# EAGLE design ReButton-ES2 (EAGLE 7.7.0)

## Sheet 1 of 3
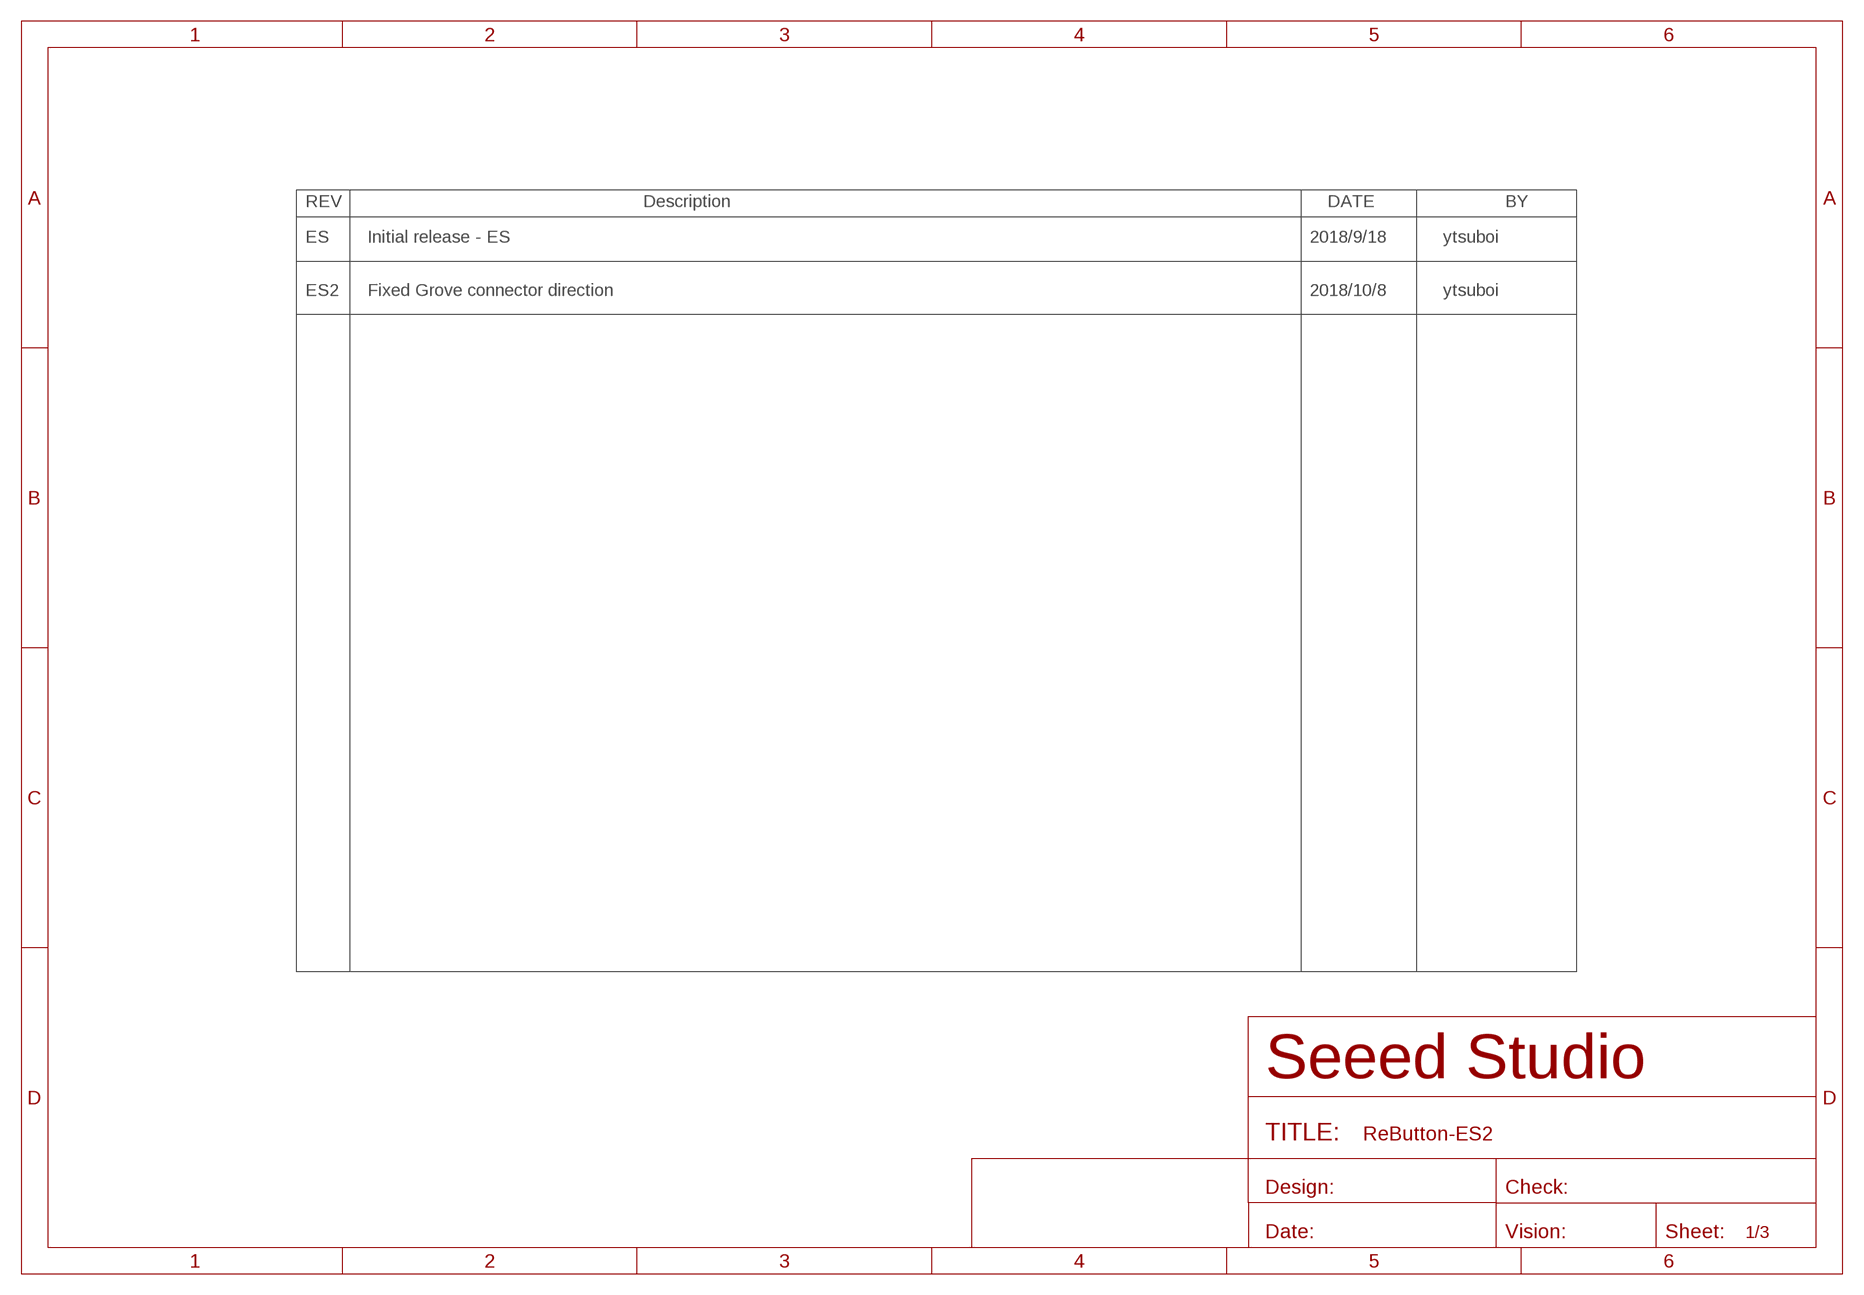
[diagram p0: schematic, sheet 1]

### Notes on the sheet
- ES | Initial release - ES | 2018/9/18 | ytsuboi
- ES2 | Fixed Grove connector direction | 2018/10/8 | ytsuboi

## Sheet 2 of 3
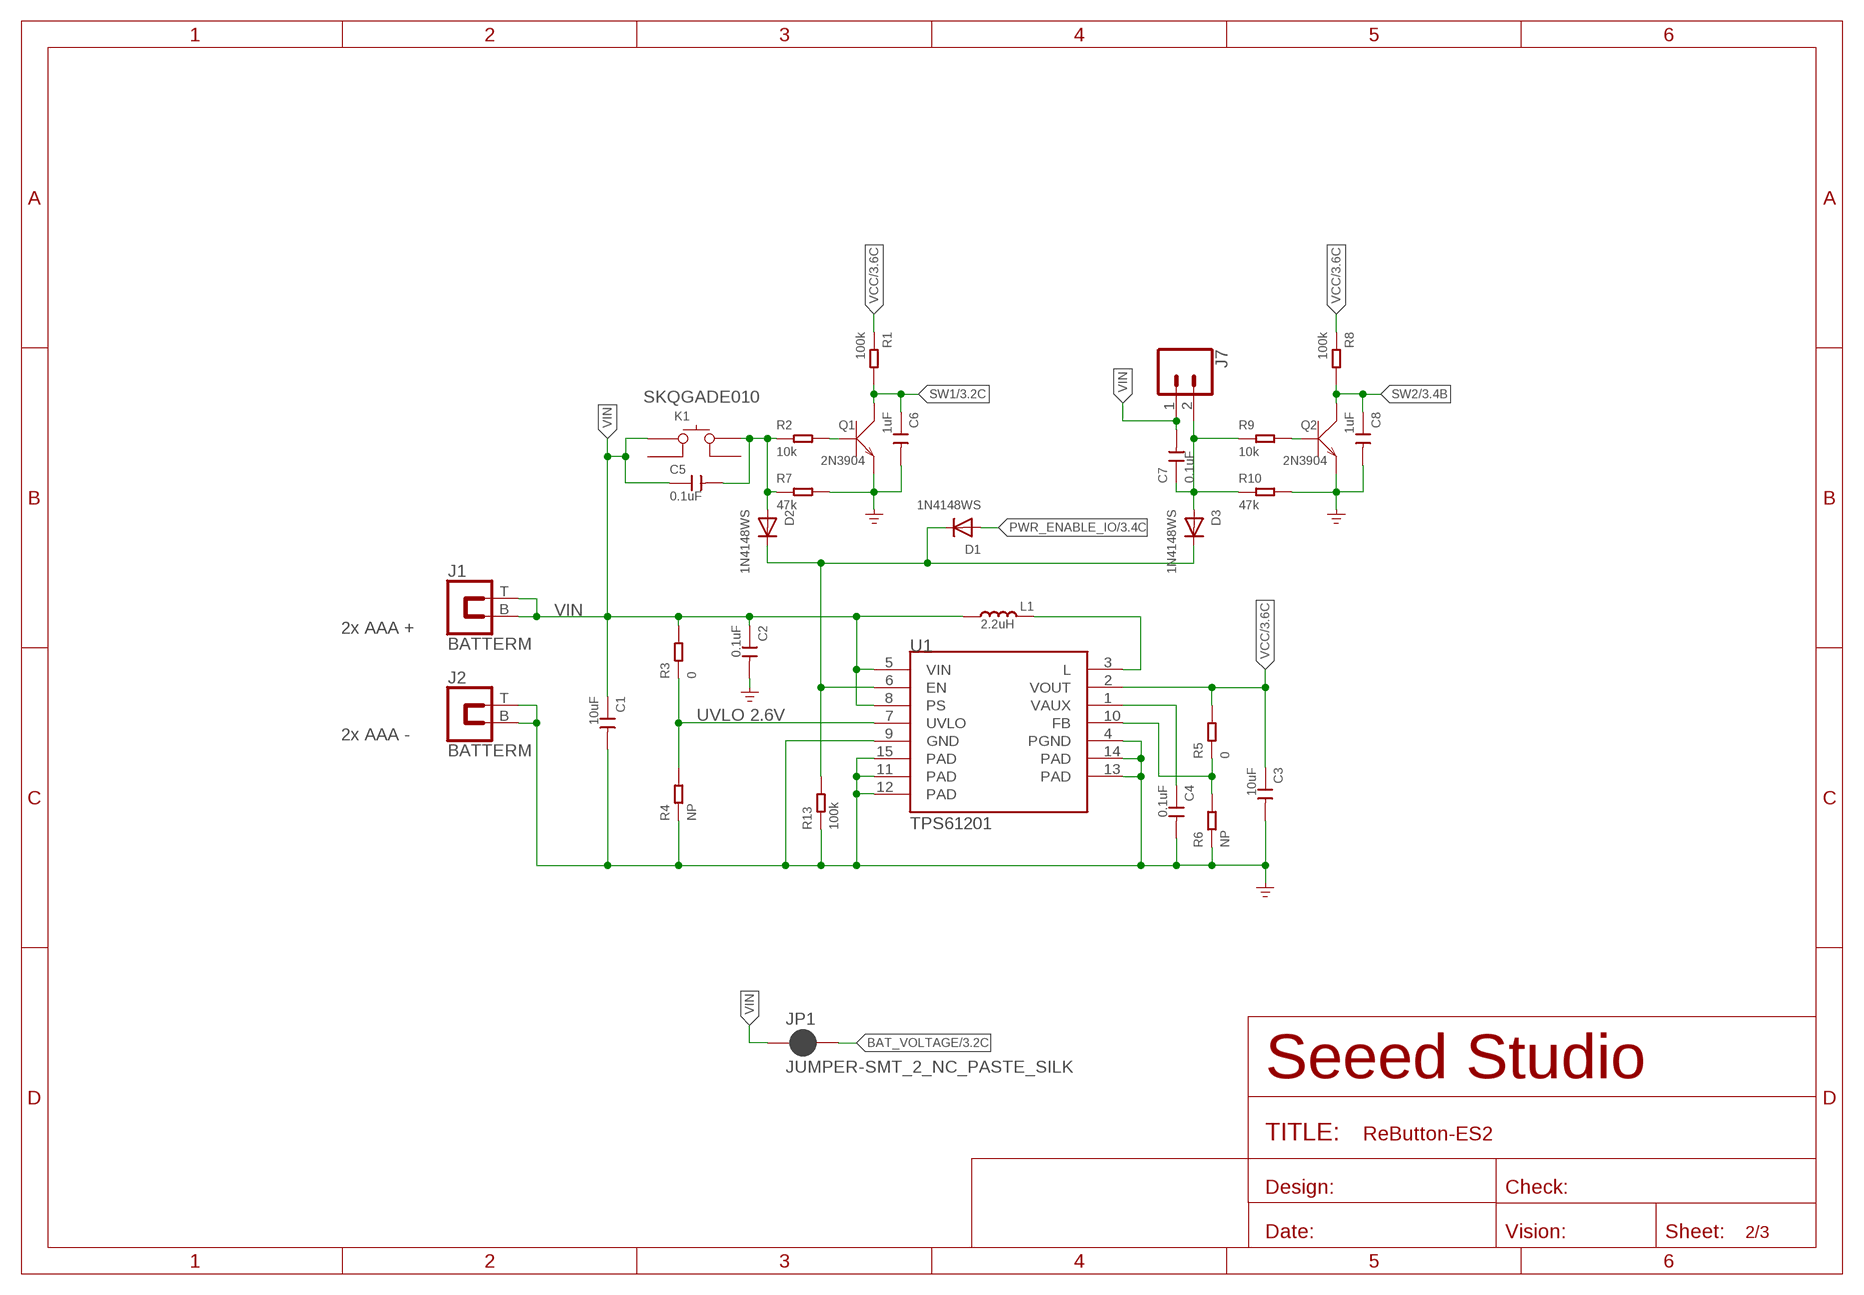
[diagram p1: schematic, sheet 2]

### Parts
C1  10uF  CAP-0805  [C0805]
C2  0.1uF  CAP-0402  [C0402]
C3  10uF  CAP-0805  [C0805]
C4  0.1uF  CAP-0402  [C0402]
C5  0.1uF  CAP-0402  [C0402]
C6  1uF  CAP-0402  [C0402]
C7  0.1uF  CAP-0402  [C0402]
C8  1uF  CAP-0402  [C0402]
D1  1N4148WS  DIODESOD-323  [SOD-323]
D2  1N4148WS  DIODESOD-323  [SOD-323]
D3  1N4148WS  DIODESOD-323  [SOD-323]
J1  BATTERM  [BATTERM]
J2  BATTERM  [BATTERM]
J7  CONN_02LOCK  [1X02_LOCK]
JP1  JUMPER-SMT_2_NC_PASTE_SILK  [SMT-JUMPER_2_NC_PASTE_SILK]
K1  BUTTON-4P-6.2X6.2  [SW4-SMD-6.2X6.2MM]
L1  2.2uH  L-NR3012  [L3030-TAIYO-YUDEN-NR3012]
Q1  2N3904  TRANSISTOR-NPN-SOT23  [SOT-23]
Q2  2N3904  TRANSISTOR-NPN-SOT23  [SOT-23]
R1  100k  RES-0402  [R0402]
R2  10k  RES-0402  [R0402]
R3  0  RES-0402  [R0402]
R4  NP  RES-0402  [R0402]
R5  0  RES-0402  [R0402]
R6  NP  RES-0402  [R0402]
R7  47k  RES-0402  [R0402]
R8  100k  RES-0402  [R0402]
R9  10k  RES-0402  [R0402]
R10  47k  RES-0402  [R0402]
R13  100k  RES-0402  [R0402]
U1  TPS61201  TPS61200  [QFN-10_PAD]

### Nets
BAT_VOLTAGE: JP1.2 ; also sheet 3
FB: R5.1 R6.2 U1.10(FB)
GND: C1.2 C2.2 C3.2 C4.2 C6.2 C8.2 J2.B J2.T Q1.2(E) Q2.2(E) R4.1 R6.1 R7.2 R10.2 R13.1 U1.4(PGND) U1.9(GND) U1.11(PAD) U1.12(PAD) U1.13(PAD) U1.14(PAD) U1.15(PAD) ; supply symbol labelled GND_POWER ; also sheet 3
N$1: C4.1 U1.1(VAUX)
N$2: L1.2 U1.3(L)
N$3: D1.C D2.C D3.C R13.2 U1.6(EN)
N$4: Q1.1(B) R2.2
N$5: C5.2 D2.A K1.2(B0) R2.1 R7.1
N$7: C7.1 D3.A J7.2 R9.1 R10.1
N$8: Q2.1(B) R9.2
PWR_ENABLE_IO: D1.A ; also sheet 3
SW1: C6.1 Q1.3(C) R1.2 ; also sheet 3
SW2: C8.1 Q2.3(C) R8.2 ; also sheet 3
UVLO: R3.1 R4.2 U1.7(UVLO)
VCC: C3.1 R1.1 R5.2 R8.1 U1.2(VOUT) ; also sheet 3
VIN: C1.1 C2.1 C5.1 C7.2 J1.B J1.T J7.1 JP1.1 K1.1(A0) L1.1 R3.2 U1.5(VIN) U1.8(PS)
Unconnected: K1.3(B1) K1.4(A1)

### Notes on the sheet
- SKQGADE010
- 2x AAA +
- UVLO 2.6V
- 2x AAA -

## Sheet 3 of 3
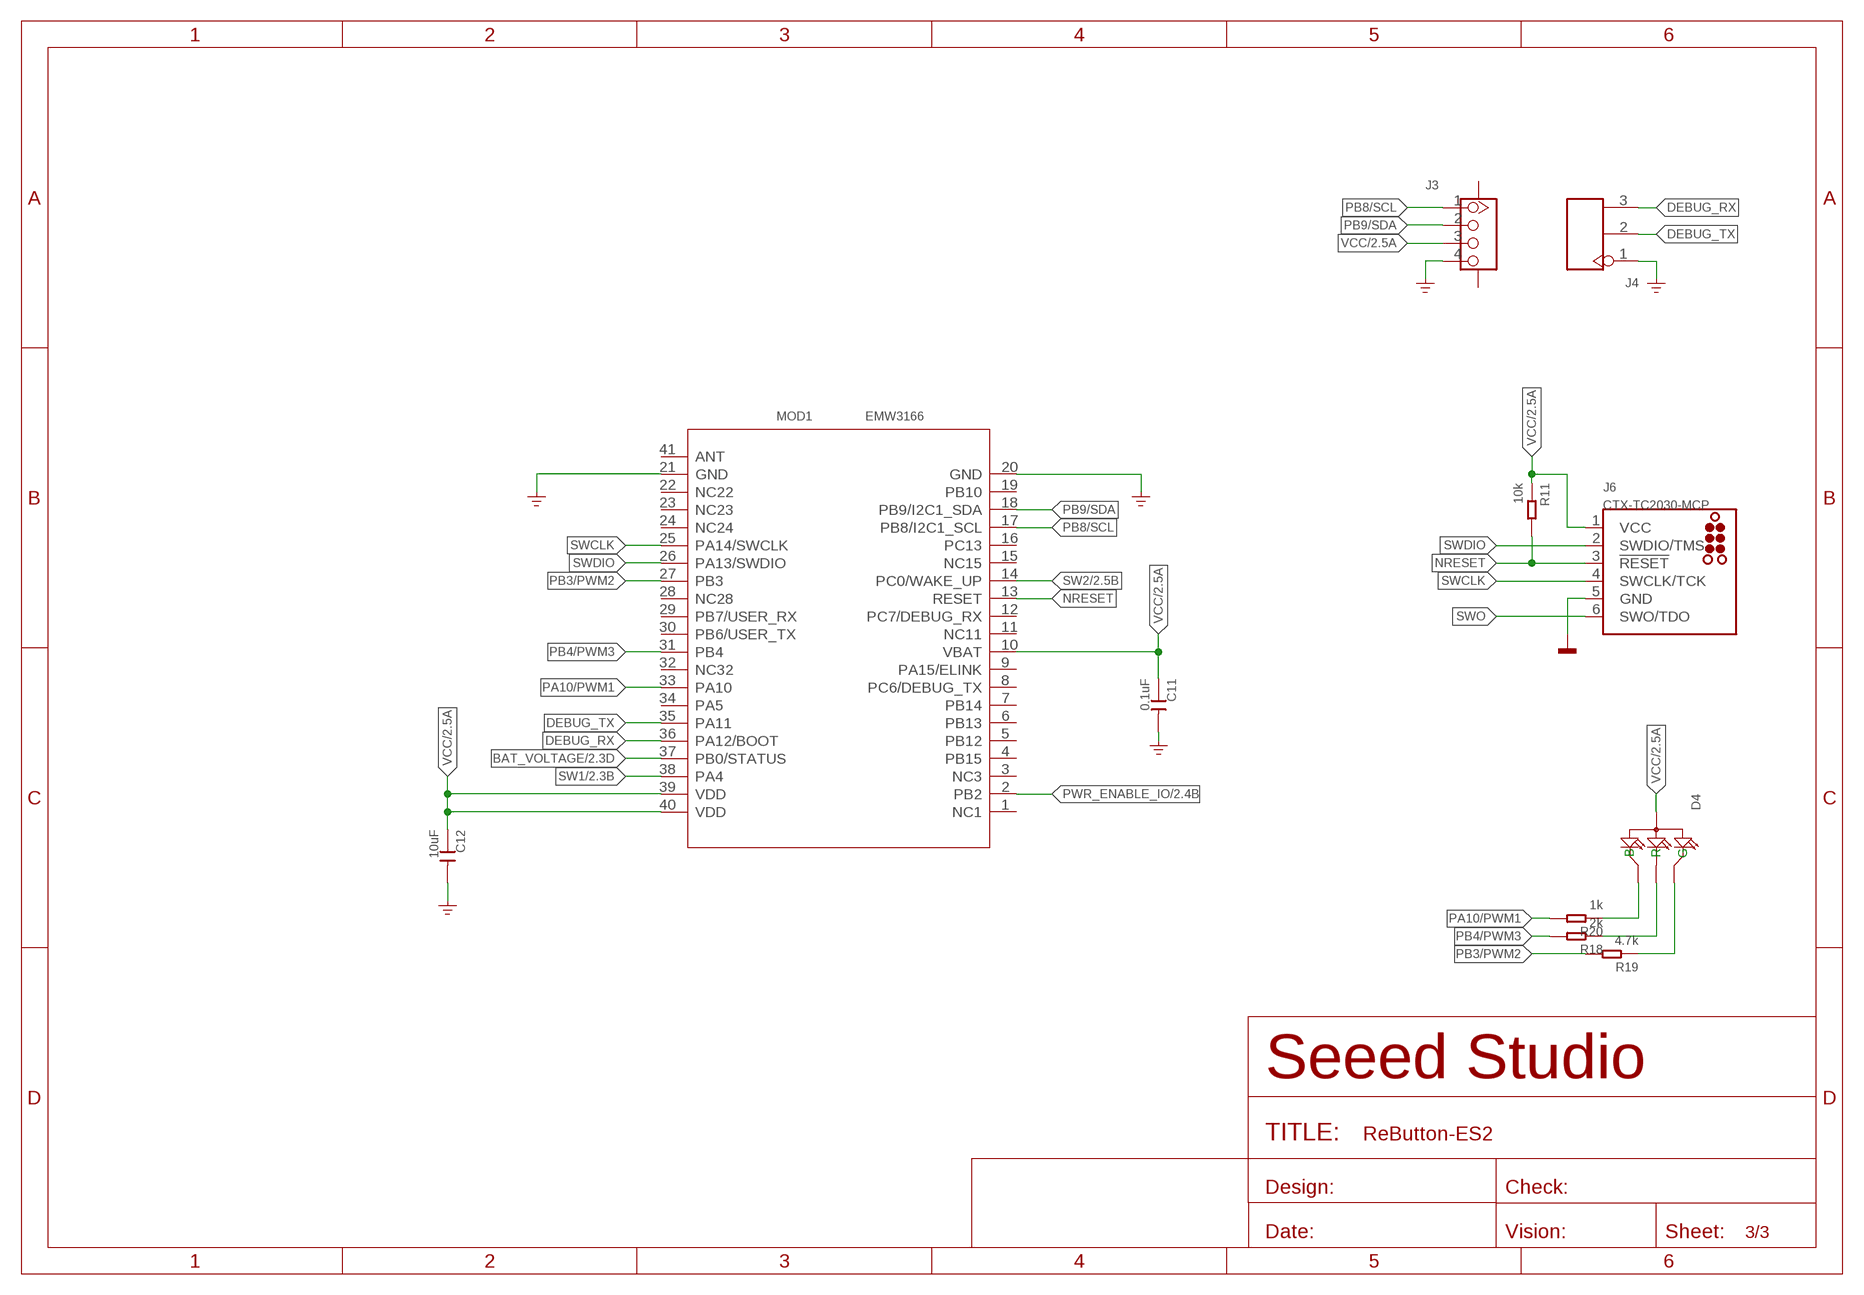
[diagram p2: schematic, sheet 3]

### Parts
C11  0.1uF  CAP-0402  [C0402]
C12  10uF  CAP-0805  [C0805]
D4  LED-ARGB-4P-19-237  [LED4-1.6X1.6X0.35MM]
J3  GROVE-CONNECTOR-SMD'DD'  [HW4-SMD-2.0]
J4  HEADER-3P  [H3-2.3-65/35MIL]
J6  CTX-TC2030-MCP  [TC2030-MCP]
MOD1  EMW3166  MODULE-WIFI-EMW3166  [MODULE-WIFI-EMW3166]
R11  10k  RES-0402  [R0402]
R18  2k  RES-0402  [R0402]
R19  4.7k  RES-0402  [R0402]
R20  1k  RES-0402  [R0402]

### Nets
BAT_VOLTAGE: MOD1.37(PB0/STATUS) ; also sheet 2
DEBUG_RX: J4.3 MOD1.36(PA12/BOOT)
DEBUG_TX: J4.2 MOD1.35(PA11)
GND: C11.2 C12.2 J3.4 J4.1 J6.5(GND) MOD1.20(GND) MOD1.21(GND) ; supply symbol labelled GND_POWER ; also sheet 2
N$6: D4.4(R) R18.1
N$9: D4.2(G) R19.1
N$10: D4.1(B) R20.1
NRESET: J6.3(!RESET!) MOD1.13(RESET) R11.2
PA10/PWM1: MOD1.33(PA10) R20.2
PB3/PWM2: MOD1.27(PB3) R19.2
PB4/PWM3: MOD1.31(PB4) R18.2
PB8/SCL: J3.1 MOD1.17(PB8/I2C1_SCL)
PB9/SDA: J3.2 MOD1.18(PB9/I2C1_SDA)
PWR_ENABLE_IO: MOD1.2(PB2) ; also sheet 2
SW1: MOD1.38(PA4) ; also sheet 2
SW2: MOD1.14(PC0/WAKE_UP) ; also sheet 2
SWCLK: J6.4(SWCLK/TCK) MOD1.25(PA14/SWCLK)
SWDIO: J6.2(SWDIO/TMS) MOD1.26(PA13/SWDIO)
SWO: J6.6(SWO/TDO)
VCC: C11.1 C12.1 D4.3(+) J3.3 J6.1(VCC) MOD1.10(VBAT) MOD1.39(VDD) MOD1.40(VDD) R11.1 ; also sheet 2
Unconnected: J3.SS1 J3.SS2 MOD1.1(NC1) MOD1.3(NC3) MOD1.4(PB15) MOD1.5(PB12) MOD1.6(PB13) MOD1.7(PB14) MOD1.8(PC6/DEBUG_TX) MOD1.9(PA15/ELINK) MOD1.11(NC11) MOD1.12(PC7/DEBUG_RX) MOD1.15(NC15) MOD1.16(PC13) MOD1.19(PB10) MOD1.22(NC22) MOD1.23(NC23) MOD1.24(NC24) MOD1.28(NC28) MOD1.29(PB7/USER_RX) MOD1.30(PB6/USER_TX) MOD1.32(NC32) MOD1.34(PA5) MOD1.41(ANT)

## Library data of the parts
C1-C8 C11 C12 = Discrete-new:CAP: Ceramic Capacitors
D1-D3 = microbuilder:DIODE: Diode SMA Model Volts Amps Type Vf Vr Digikey # Notes SSA34-E3 40V 3A Schottky 480mV @ 3A 200uA @ 40V SSA34-E3/61TGITR-ND CDBA120-G 20V 1A Schottky 500mV @ 1A 500uA @ 20V 641-1014-6-ND REEL MBRA210 10V 2A Schottky 350mV @ 2A 700uA @ 10V MBRA210LT3 SOD-123 Model Volts Amps Type Vf Vr Order # Notes BAT54T1G 30V 200mA Schottky 800mV @ 200mA 2uA @ 25V BAT54T1GOSTR-ND B0530W 30V 500mA Schottky 430mV @ 500mA 130uA @ 30V B0530W-FDICT-ND REEL MBR120 1A 20V Schottky 340mV @ 1A MBR120VLSFT1GOSCT-ND SOD-323 Model Volts Amps Type Vf Vr Order # Notes PMEG2005EJ 20V 500mA Schottky 355mV @ 500mA 568-4110-1-ND ZLLS410 10V 570mA Schottky 380mV @ 570mA ZLLS410CT-ND 1N4148WS 75V 150mA Silicon/Simple 1V 1N4148WSFSCT-ND REEL SOD-523 Model Volts Amps Type Vf Vr Order # Notes BAT54XV2 30V 200mA Schottky 0.8V @ 100mA BAT54XV2CT-ND TB751S 30V 30mA Schottky RB751S-40TE61CT-ND SOT23-R/W (R = Solder Paste/Reflow Ovens, W = Hand-Soldering) Model Volts Amps Type Vf Vr Order # Notes BAT54FILM 40V 300mA Schottky 497-7162-1-ND
D4 = Discrete-new:LED-ARGB-4P
J1 J2 = batterm:BATTERM
J3 = Connector-new:GROVE-CONNECTOR-SMD: 4P-SMD-2.0:320110030;4P-SMD-2.0-90D:320110032
J4 = Connector-new:HEADER-3P
J6 = tag-connect:CTX-TC2030: TAG-CONNECT 10-Pin Cortex Debug Connector Manufacturer: Tag-Connect <http://www.tag-connect.com> Cable for easy In-Circuit Serial Programming. Designed for ARM Cortex processors. Two variants - one "with legs" (for hands-free fit on PCB) and another "without legs" for quick programming. PAD Description 1 VCC 2 SWDIO/TMS 3 nRESET 4 SWCLK/TCK 5 GND 6 SWO/TDO Modified and updated by Yoshihiro TSUBOI ‹ytsuboi@gmail.com›
J7 = SparkFun-Connectors:CONN_02: Multi connection point. Often used as Generic Header-pin footprint for 0.1 inch spaced/style header connections On any of the 0.1 inch spaced packages, you can populate with these: Break Away Headers - Straight <https://www.sparkfun.com/products/116> (PRT-00116) Break Away Male Headers - Right Angle <https://www.sparkfun.com/products/553> (PRT-00553) Female Headers <https://www.sparkfun.com/products/115> (PRT-00115) Break Away Headers - Machine Pin <https://www.sparkfun.com/products/117> (PRT-00117) Break Away Female Headers - Swiss Machine Pin <https://www.sparkfun.com/products/743> (PRT-00743) For SCREWTERMINALS and SPRING TERMINALS visit here: Screw Terimnals on SparkFun.com <https://www.sparkfun.com/search/results?term=Screw+Terminals> (5mm/3.5mm/2.54mm spacing) This device is also useful as a general connection point to wire up your design to another part of your project. Our various solder wires solder well into these plated through hole pads. Hook-Up Wire - Assortment (Stranded, 22 AWG) <https://www.sparkfun.com/products/11375> (PRT-11375) Hook-Up Wire - Assortment (Solid Core, 22 AWG) <https://www.sparkfun.com/products/11367> (PRT-11367) View the entire wire category on our website here <https://www.sparkfun.com/categories/141> Special notes: Molex polarized connector foot print use with: PRT-08233 with associated crimp pins and housings. 2.54_SCREWTERM for use with PRT-10571. 3.5mm Screw Terminal footprints for PRT-08084 5mm Screw Terminal footprints for use with PRT-08432
JP1 = SparkFun-Jumpers:JUMPER-SMT_2_NC_PASTE: Normally closed solder jumper This jumper has an aperture in the stencil to allow solder paste to bridge the split in the wire so it's normally closed (NC). Wick off the solder to open the connection. Reapply solder to reclose the connection.
K1 = Discrete-new:BUTTON-4P: SW4-6.0X6.0X5.0MM:311020024;SW4-8.0X8.0X9.0MM:311020028;SW4-SMD-6.0X6.0X5.0MM:311020004;SW4-SMD-3.35X3.35X1.5MM:311020030;SW4-SMD-5.2X5.2X2.5MM:311020046
L1 = Discrete-new:L
MOD1 = moudle-new:MODULE-WIFI-EMW3166
Q1 Q2 = Discrete-new:TRANSISTOR-NPN: NPN audion
R1-R11 R13 R18-R20 = Discrete-new:RES
U1 = SparkFun:TPS61200: DC to DC Booster

## Net classes
0 default: width 0.127 mm, clearance 0.127 mm

## Board
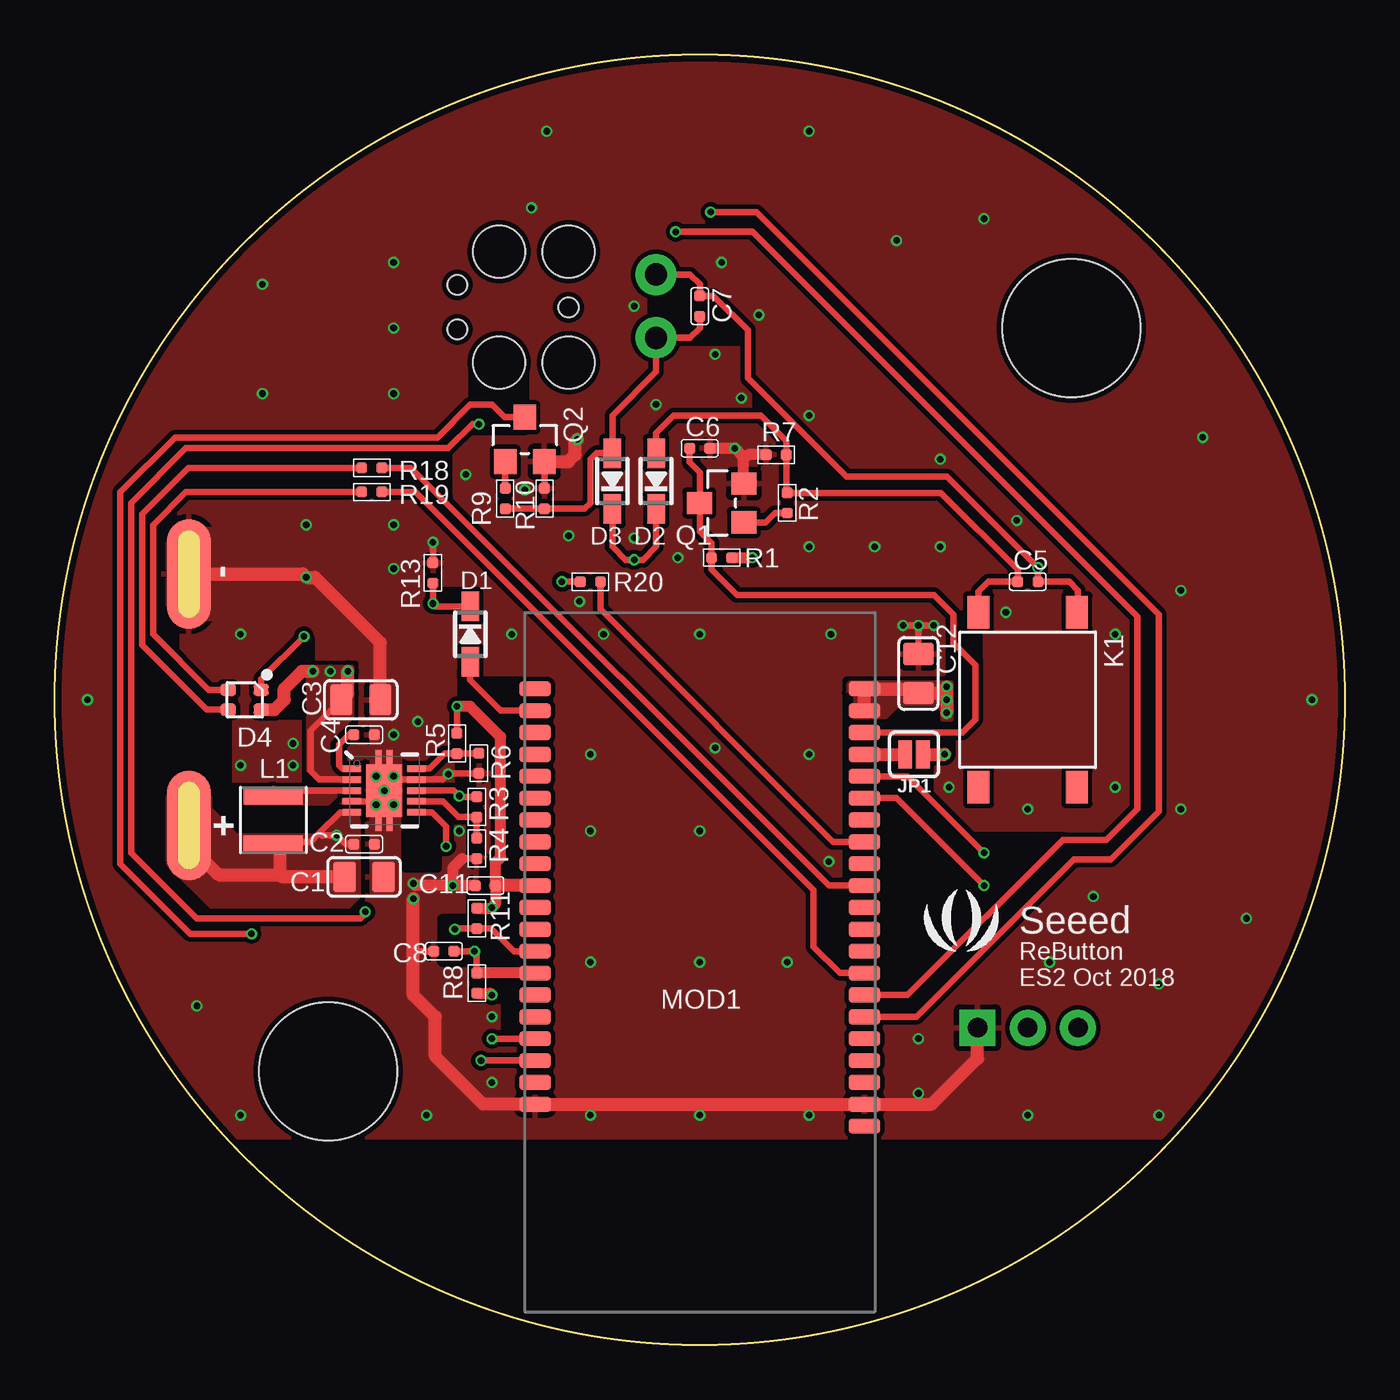
[diagram p3: board, top side]
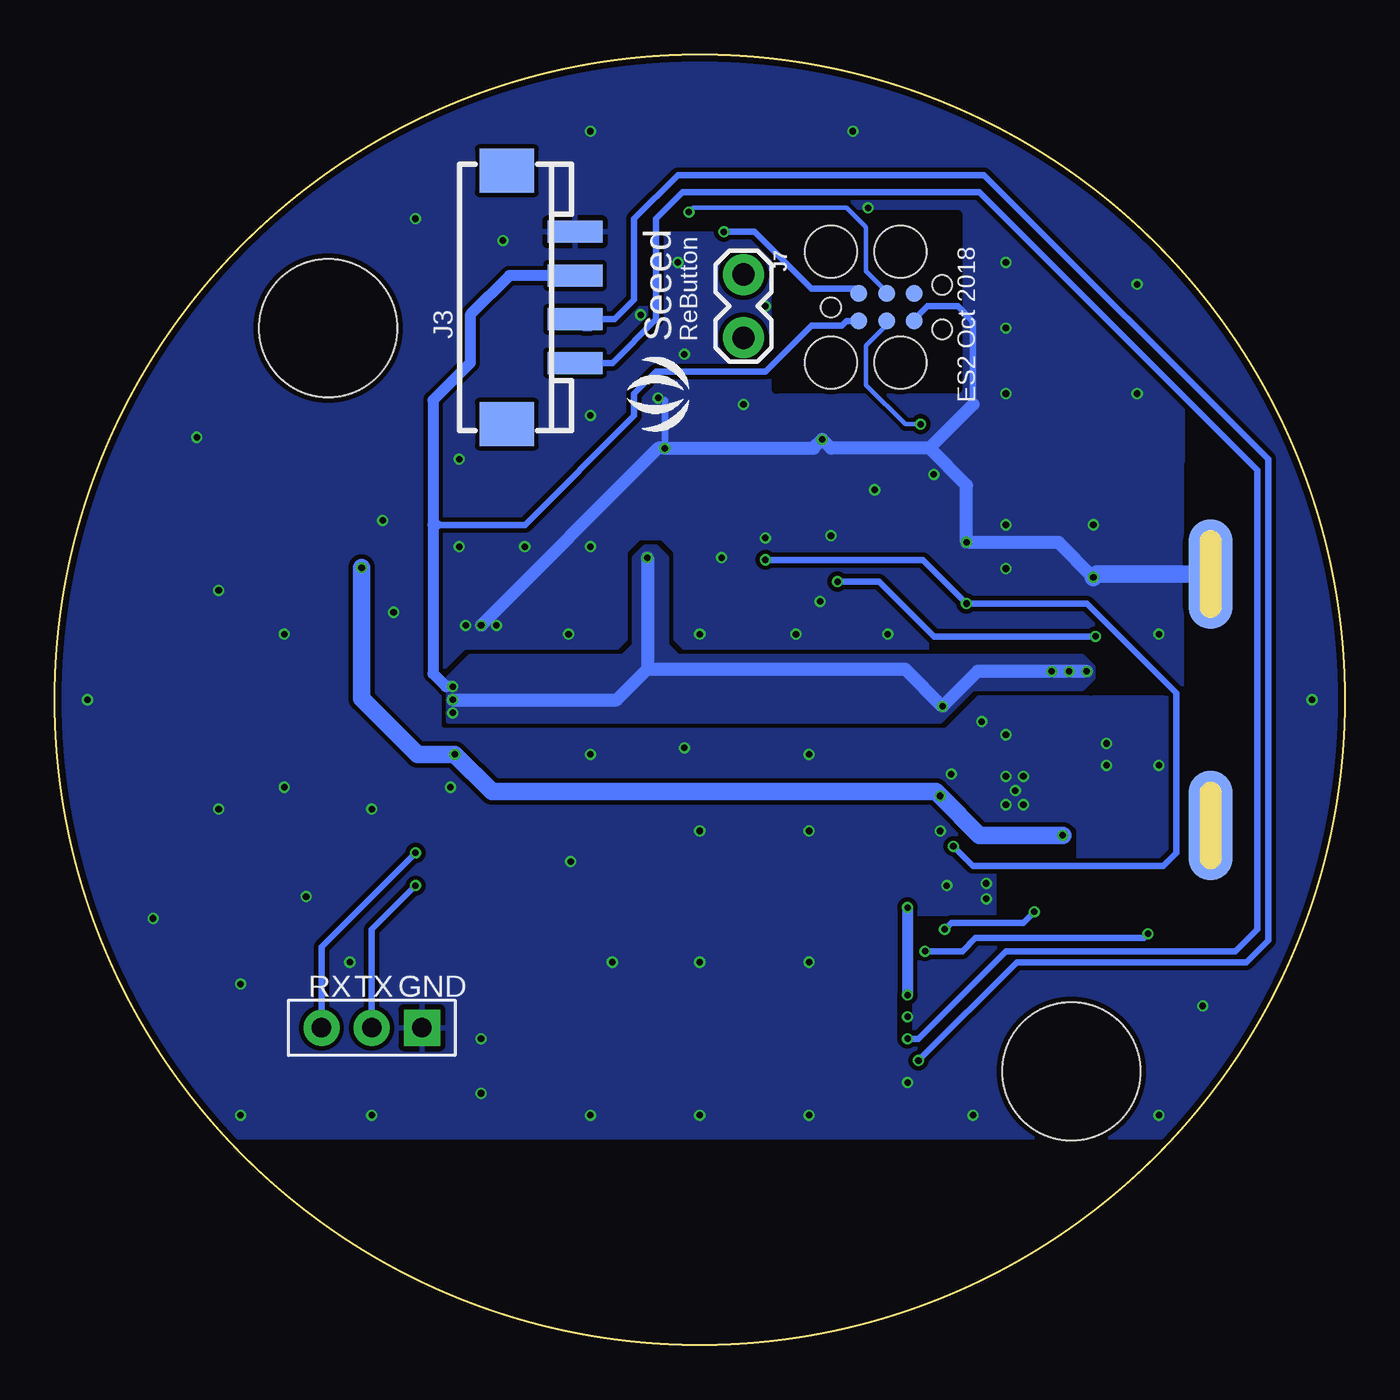
[diagram p4: board, bottom side, seen from below]

Size 59 x 59 mm. Coordinates in mm from the lower left corner, seen from the top.
Outline: circle at 29.5,29.5 radius 29.5
Copper layers (1*16): Top 0.035mm / dielectric 1.5mm / Bottom 0.035mm
Design rules "SeeedStudio_2layer_DRU_no_angle_20140221": minimum track width 1mil, minimum drill 10mil, track to track 6mil, track to pad 6mil, pad to pad 6mil, via to via 6mil, smd to smd 0mil, copper to edge 10mil, drill to drill 10mil, minimum pad ring 4mil, minimum via ring 4mil, stop-mask expansion 2mil, vias tented up to drill 25mil, thermal gap 10mil
Holes 6.3 mm at 46.5,46.5 12.5,12.5
tKeepout: area 42.6,42.6 to 50.4,50.4; area 8.6,8.6 to 16.4,16.4
tRestrict: area 10.1,28.8 to 11.3,29.1; area 3.6,26.1 to 5.1,26.2; area 7.4,25.3 to 8.4,25.5; area 11.5,31.3 to 11.7,32.3; area 5.1,31.4 to 5.5,33.5; area 18.5,25.3 to 18.8,26.8; area 41.9,22.8 to 46.1,23.2; area 19.8,15.8 to 21.3,15.9; area 17.8,38.8 to 18,40.8; area 11.5,25.7 to 11.6,26; area 40.8,27.2 to 41,27.8; area 39.7,25.4 to 40,26.4; area 41,30.5 to 41.1,32.1; area 41.9,31.3 to 42.2,32.8; area 7.6,25.5 to 7.9,28.8; area 19.1,41.8 to 21.5,44.9; area 28.6,45.9 to 31.5,46.1; area 32.1,42.6 to 32.2,43.6; area 19,22.3 to 19.3,24; area 16,21.8 to 17.5,24.2; area 19,18.8 to 19.3,20.5; area 17.7,17.5 to 19,19.5; area 20.6,14.2 to 20.7,15.7; area 18.6,29.2 to 18.8,30.8; area 19.6,21.1 to 19.7,22; area 27.3,46.9 to 27.5,48.2; area 36.2,20.9 to 36.5,29.8; area 19.6,30.1 to 21.4,30.4; area 17.6,34 to 18.9,34.4
bRestrict: area 17.7,43.7 to 26,51.7; area 4.3,30.2 to 5.2,30.5; area 12.5,21.9 to 12.7,23.5; area 15.6,19.4 to 15.7,22.2; area 6.7,40.2 to 7.1,42.8; area 18.7,31.7 to 18.8,32.2; area 8.2,29.9 to 11.6,30.2; area 17.9,19.2 to 19.9,19.4; area 28,51.1 to 31.9,51.6; area 20,14.1 to 20.2,16; area 31.5,47.7 to 32.5,48.1
Milling: 1 lines

### Footprints (pad centres in the part's own frame; a part is rotated, then mirrored left to right if it is on the bottom)
C0805 = smd 1.397 x 1.016: 1 0,0.889; 2 0,-0.889
C0402 = smd 0.5 x 0.5: 1 0,0.463; 2 0,-0.463
SOD-323 = smd 1.35 x 0.8: A 1.27,0; C -1.27,0
LED4-1.6X1.6X0.35MM = smd 0.7 x 0.55: 1 -0.75,-0.45; 2 0.75,-0.45; 3 -0.75,0.45; 4 0.75,0.45
BATTERM = smd 5 x 2 bottom: B 0,0 | smd 5 x 2: T 0,0
HW4-SMD-2.0 = smd 1 x 2.5: 1 -3,0; 2 -1,0; 3 1,0; 4 3,0 | smd 2 x 2.5: SS1 -5.8,3.123; SS2 5.8,3.123
H3-2.3-65/35MIL = drill 0.889 pad 1.651 square: 1 0,2.3 | drill 0.889 pad 1.651: 2 0,0; 3 0,-2.3
TC2030-MCP = smd 0.787 x 0.787: 1 1.27,-0.635; 2 1.27,0.635; 3 2.54,-0.635; 4 2.54,0.635; 5 3.81,-0.635; 6 3.81,0.635 | hole 0.889: 0,0; 5.08,-1.016; 5.08,1.016 | hole 2.375: 0,2.54; 0,-2.54; 3.175,-2.54; 3.175,2.54
1X02_LOCK = drill 1.016 pad 1.88: 1 -0.178,0; 2 2.718,0
SMT-JUMPER_2_NC_PASTE_SILK = smd 0.635 x 1.27: 1 -0.406,0; 2 0.406,0
SW4-SMD-6.2X6.2MM = smd 1.5 x 1: 1 -4,2.25; 2 -4,-2.25; 3 4,-2.25; 4 4,2.25
L3030-TAIYO-YUDEN-NR3012 = smd 0.8 x 2.7: 1 -1.1,0; 2 1.1,0
MODULE-WIFI-EMW3166 = smd 1.45 x 0.7: 1 7.525,-12.5; 2 7.525,-11.5; 3 7.525,-10.5; 4 7.525,-9.5; 5 7.525,-8.5; 6 7.525,-7.5; 7 7.525,-6.5; 8 7.525,-5.5; 9 7.525,-4.5; 10 7.525,-3.5; 11 7.525,-2.5; 12 7.525,-1.5; 13 7.525,-0.5; 14 7.525,0.5; 15 7.525,1.5; 16 7.525,2.5; 17 7.525,3.5; 18 7.525,4.5; 19 7.525,5.5; 20 7.525,6.5; 21 -7.525,6.5; 22 -7.525,5.5; 23 -7.525,4.5; 24 -7.525,3.5; 25 -7.525,2.5; 26 -7.525,1.5; 27 -7.525,0.5; 28 -7.525,-0.5; 29 -7.525,-1.5; 30 -7.525,-2.5; 31 -7.525,-3.5; 32 -7.525,-4.5; 33 -7.525,-5.5; 34 -7.525,-6.5; 35 -7.525,-7.5; 36 -7.525,-8.5; 37 -7.525,-9.5; 38 -7.525,-10.5; 39 -7.525,-11.5; 40 -7.525,-12.5; 41 -7.525,7.5
SOT-23 = smd 1.143 x 1.016: 1 1.016,-0.889; 2 1.016,0.889; 3 -1.016,0
R0402 = smd 0.5 x 0.5: 1 0,0.463; 2 0,-0.463
QFN-10_PAD = smd 0.297 x 0.85: 1 -1,-1.475; 2 -0.5,-1.475; 3 0,-1.475; 4 0.5,-1.475; 5 1,-1.475; 6 1,1.475; 7 0.5,1.475; 8 0,1.475; 9 -0.5,1.475; 10 -1,1.475 | smd 0.7 x 0.28: 11 -1.5,0.25; 12 -1.5,-0.25; 13 1.5,0.25; 14 1.5,-0.25 | smd 2.4 x 1.65: 15 0,0

### Placement (x,y rotation side)
C1  14.15,21.4 90 top
C2  14.15,22.9 90 top
C3  14,29.5 90 top
C4  14.15,27.9 90 top
C5  44.5,34.9 270 top
C6  29.5,41 90 top
C7  29.5,47.5 180 top
C8  17.8,18 270 top
C11  19.7,21 270 top
C12  39.5,30.7 180 top
D1  19,32.5 270 top
D2  27.5,39.5 90 top
D3  25.5,39.5 90 top
D4  8.69,29.5 180 top
J1  6.14,23.75 90 top
J2  6.14,35.25 90 top
J3  35.2,47.9 90 bottom
J4  44.5,14.5 270 bottom
J6  23.5,47.45 0 bottom
J7  27.5,48.77 270 bottom
JP1  39.3,27 180 top
K1  44.5,29.5 270 top
L1  10,24 90 top
MOD1  29.5,17.5 180 top
Q1  30.5,38.5 0 top
Q2  21.5,41.4 270 top
R1  30.5,36 270 top
R2  33.5,38.5 0 top
R3  19.3,24.6 180 top
R4  19.3,22.7 180 top
R5  18.4,27.5 180 top
R6  19.4,26.6 180 top
R7  33,40.7 270 top
R8  19.3,16.54 180 top
R9  20.6,38.7 180 top
R10  22.4,38.7 180 top
R11  19.3,19.5 0 top
R13  17.3,35.3 0 top
R18  14.5,40.1 90 top
R19  14.5,39 90 top
R20  24.5,34.9 90 top
U1  15.07,25.35 270 top
U$9  [SEEED-SILK--TNAME-160*153MIL]  31.5,43.5 90 bottom
U$15  [SEEED-SILK--TNAME-160*153MIL]  41.5,19.5 0 top

### Tracks (layer width: path | path; a pad name or v marks a point on that pad's centre or on a via)
BAT_VOLTAGE
  Top 0.6: MOD1.37 JP1.2
DEBUG_RX  (via drill 0.3)
  Top 0.3: MOD1.36 39,26 v42.5,22.5
  Bottom 0.3: v42.5,22.5 46.8,18.2 J4.3
DEBUG_TX  (via drill 0.3)
  Top 0.3: MOD1.35 38.5,25 v42.5,21
  Bottom 0.3: v42.5,21 44.5,19 J4.2
FB
  Top 0.3: U1.10 17.15,26.35 17.84,27.04 R5.1 19.38,27.04 R6.2
GND  (via drill 0.3)
  Top 0.254: 14.86,24.85 15.12,24.59 | U1.9 | 15.57,25.85 15.58,25.86 15.59,25.85
  Top 0.3: U1.4 14.86,24.85 | 15.59,25.85 U1.9 17.75,25.85 v18,26.1 18.04,26.14 R6.1 | 31.5,39.41 Q1.2 | C12.2 v39.5,32.9 | v40.2,32.9 v39.5,32.9 | v39.5,32.9 v38.8,32.9 | R13.1 v17.3,36.7 | C8.2 16.4,18 | R10.2 Q2.2 | R4.1 18.64,22.24
  Top 0.5: C6.2 31,41 | 31.5,39.41 31.5,40.5 | 31.5,40.5 31.5,40.6 v31.1,41 | R7.2 31.7,40.7 31.5,40.5 | C11.2 v18.2,21 | 18.64,22.24 18.2,21.8 v18.2,21 | v18.2,21 16.5,21 v16.4,21.1
  Top 0.6: v16.4,20.4 16.4,18 16.4,16 17.4,15 17.4,13.2 19.6,11 MOD1.20 MOD1.21 40.1,11 42.2,13.1 J4.1 | J2.B 11.35,35.25 v11.5,35.1 11.9,35.1 14.89,32.11 C3.2 | Q2.2 23.48,40.38 23.8,40.7 23.8,41.3 v23.9,41.4
  Bottom 0.3: J6.5 19.69,46.91 19.1,47.5 17.7,47.5 17,46.8 17,43 | v31.1,41 31.1,43.2
  Bottom 0.6: v39.5,32.9 31.4,41 v31.1,41 24.3,41 v23.9,41.4 23.5,41 19,41 | 19,41 17,43 | v11.5,35.1 13.1,36.7 v17.3,36.7 17.3,39.3 19,41
  Bottom 0.8: J2.B 11.35,35.25 v11.5,35.1
  other vias: 14.7,26 15.07,25.35 15.5,26 14.7,24.7 15.5,24.7 15.5,27.9 16.6,28.5 26.5,47.5 21.8,52 30.5,49.5 34.5,55.5 22.5,55.5 9.5,43.5 9.5,48.5 1.5,29.5 42.5,51.5 40.5,36.5 34.5,36.5 8.5,26.5 10.9,27.5 43.5,33.5 31.4,43.3 26.5,36.9 30.2,27.3 29.5,32.5 20.9,32.5 40.9,25.5 50.5,10.5 57.5,29.5 20,12 39.5,11.5 39.5,14 20,15 17,10.5 8.5,10.5 6.5,15.5 18.8,39.8 21.5,39.1 27.5,43 44,37.7 40.5,40.5 48.5,25.5 29.5,17.5 34.5,27 35.5,32.5 23.5,37 29.5,10.5 29.5,23.5 24.5,17.5 33.5,17.5 34.5,10.5 24.5,10.5 45.5,17.5 52.5,41.5 54.5,19.5 28.5,36 15.5,46.5 30.2,45.3 18.5,23.5 25.1,32.5 37.5,36.5 24.5,23.5 24.5,27 35.4,22.1 24,34 50.5,16.5 11.5,37.5 15.5,37.5 15.5,35.5 10.9,26.5 8.5,32.5 44.5,10.5 51.5,34.5 51.5,24.5 15.5,43.5 15.5,49.5 48.5,32.5 44.5,24.5 34.5,42.5 38.5,50.5 47.5,20.5 32.2,47.1
  pour Top (isolate 0.2, no thermals): 15.8,33.2 15.8,22.3 16.8,21.3 16.8,20.1 15,20.1 14.5,20.6 14.5,31.2 12.5,33.2 5.8,33.2 5.2,33.8 5.2,36.7 5.8,37.3 11.7,37.3
  pour Bottom (isolate 0.2, rank 2): -0.5,9.5 59.5,9.5 59.5,59.5 -0.5,59.5
  pour Top (isolate 0.2, rank 2): -0.5,9.5 59.5,9.5 59.5,59.5 -0.5,59.5
N$1
  Top 0.3: U1.1 13.15,26.35 13,26.5 13,27.45 13.45,27.9 C4.1
N$2
  Top 0.3: U1.3 10,25.35
  Top 0.406: 10,25.35 L1.2
  pour Top (isolate 0.2): 13.2,25.3 13.2,25.25 13,25.25 12.5,24.75 8.75,24.75 8.75,25.3
N$3  (via drill 0.3)
  Top 0.3: R13.2 v17.3,33.9 17.43,33.77 D1.C | D3.C 25.5,36.5 26.1,35.9 v26.5,35.9 26.9,35.9 27.5,36.5 D2.C | U1.6 17.25,24.35 17.9,23.7 v17.9,22.8
  Bottom 0.3: v26.5,35.9 19.3,35.9 v17.3,33.9 11.8,33.9 7.7,29.8 7.7,22.5 8.3,21.9 17,21.9 v17.9,22.8
N$4
  Top 0.3: R2.2 32.94,38.04 32.5,37.6 Q1.1
N$5
  Top 0.3: K1.2 42.25,34.45 42.7,34.9 C5.2 44.04,35.46 40.54,38.96 R2.1 33.46,39 R7.1 33.46,41.34 32.3,42.5 28.3,42.5 27.5,41.7 D2.A
N$6
  Top 0.3: R18.1 6.1,40.1 4,38 4,32 6.95,29.05 D4.4
N$7
  Top 0.3: C7.1 29.5,46.5 29.05,46.05 J7.2 27.5,44.5 25.5,42.5 D3.A 24.77,40.77 24.5,40.5 24.5,38.5 24.24,38.24 R10.1 R9.1
N$8
  Top 0.3: R9.2 Q2.1
N$9
  Top 0.3: R19.1 6,39 4.5,37.5 4.5,32.5 7.05,29.95 D4.2
N$10  (via drill 0.3)
  Top 0.3: D4.1 9.44,30.44 v11.4,32.4 | R20.1 v23.2,34.9
  Bottom 0.3: v11.4,32.4 18.8,32.4 21.3,34.9 v23.2,34.9
NRESET  (via drill 0.3)
  Top 0.3: MOD1.13 21,18 19.96,19.04 R11.2 18.34,19.04 v18.3,19 | v14.2,19.8 14.2,19.7 14,19.5 6.5,19.5 3.5,22.5 3.5,38.5 6,41 18,41 19.1,42.1 v19.4,42.1
  Bottom 0.2: 20.96,46.74 20.96,46.64 21.9,45.7 21.9,43.9 20.1,42.1 v19.4,42.1
  Bottom 0.3: J6.3 20.96,46.74 | v18.3,19 18,19.3 14.7,19.3 v14.2,19.8
PA10/PWM1
  Top 0.3: R20.2 24.96,33.64 35.6,23 MOD1.33
PB3/PWM2
  Top 0.3: MOD1.27 35.9,17 34.7,18.2 34.7,20.8 16.5,39 R19.2
PB4/PWM3
  Top 0.3: MOD1.31 35.4,21 16.3,40.1 R18.2
PB8/SCL  (via drill 0.3)
  Top 0.3: v20,14 MOD1.17
  Bottom 0.3: v20,14 19.5,14 15.5,18 5,18 4,19 4,40 16.7,52.7 30.3,52.7 31.5,51.5 31.5,46.9 33.5,44.9 J3.1
PB9/SDA  (via drill 0.3)
  Top 0.3: v19.5,13 MOD1.18
  Bottom 0.3: v19.5,13 15,17.5 4.5,17.5 3.5,18.5 3.5,40.5 16.5,53.5 30.5,53.5 32.5,51.5 32.5,47.8 33.4,46.9 34.1,46.9 34.5,46.5 34.8,46.5 J3.2
PWR_ENABLE_IO
  Top 0.3: D1.A 19,30.4 20.4,29 MOD1.2
SW1
  Top 0.3: C6.1 29.04,40.36 29.5,39.9 29.5,38.52 Q1.3 29.5,38.48 29.5,37.2 30.04,36.66 R1.2 30.04,35.46 31.2,34.3 40.2,34.3 41.1,33.4 41.1,32.1 42.1,31.1 42.1,28.6 41.5,28 MOD1.38
SW2  (via drill 0.3)
  Top 0.3: R8.2 19.3,17.9 v19.2,18 C8.1 | Q2.3 20.58,42.42 20,43 19,43 17.5,41.5 5.5,41.5 3,39 3,22 6.2,18.8 v9,18.8
  Top 0.5: MOD1.14 R8.2
  Bottom 0.3: v19.2,18 17.5,18 16.9,18.6 9.2,18.6 v9,18.8
SWCLK  (via drill 0.3)
  Top 0.3: MOD1.25 39.4,15 46.6,22.2 48.3,22.2 50.5,24.4 50.5,33.4 32.1,51.8 v30,51.8
  Bottom 0.2: 20.96,48.16 21.9,49.1 21.9,51.1 22.8,52 29.8,52 v30,51.8
  Bottom 0.3: J6.4 20.96,48.16
SWDIO  (via drill 0.3)
  Top 0.3: MOD1.26 39,16 46.1,23.1 48.1,23.1 49.5,24.5 49.5,33.3 31.9,50.9 v28.4,50.9
  Bottom 0.3: J6.2 22.23,48.13 22.4,48.3 24.4,48.3 27,50.9 v28.4,50.9
UVLO
  Top 0.254: U1.7
  Top 0.3: U1.7 17.76,24.84 18.46,24.14 R3.1 R4.2
VCC  (via drill 0.3)
  Top 0.3: U1.2 12.1,25.85 11.7,26.25 11.7,28.09 C3.1 | R5.2 v18.4,29.2
  Top 0.5: R1.1 v31.9,36 | R11.1 19.96,19.96 v20,20 20.16,20.16 C11.1 20.16,22.06 20.4,22.3 20.4,27.8 19,29.2 v18.4,29.2 | R8.1 19.93,16.07 v20,16
  Top 0.6: MOD1.10 C11.1 | D4.3 10.05,29.05 10.5,29.5 10.5,30 11.3,30.8 v11.8,30.8 | C3.1 13.4,29.79 v13.4,30.8 | MOD1.39 MOD1.40 39.31,30 C12.1 40.51,29.81 v40.8,30.1 v40.8,29.5 v40.8,28.9
  Bottom 0.3: J6.1 22.79,46.81 23,46.6 24.4,46.6 26.5,44.5 31.5,44.5 32.5,43.5 32.5,42.5 37.5,37.5 41.4,37.5 | 41.4,37.5 41.7,37.5 | 41.38,37.52 41.4,37.5 | 41.4,37.5 41.6,37.3 | 41.4,37.5 41.6,37.7
  Bottom 0.5: v20,20 v20,16 | J3.3 38.2,48.9 40,47.1 40,44.9 41.7,43.2 41.7,37.5 41.7,30.7 41.1,30.1 v40.8,30.1
  Bottom 0.6: v31.9,36 31.9,30.9 | v11.8,30.8 v12.6,30.8 v13.4,30.8 16.8,30.8 v18.4,29.2 20.1,30.9 31.9,30.9 | v40.8,29.5 33.3,29.5 31.9,30.9
  pour Top (isolate 0.2, no thermals): 13.6,31 13.6,28.7 12.5,27.6 12.5,26.5 13,26 13,25.8 12.1,25.8 11.6,26.25 11.6,31
  pour Top (no thermals): 41,30.3 36.4,30.3 36.3,30.2 36.3,28.8 36.4,28.7 38,28.7 38.6,29.3 40.3,29.3 40.6,29 40.6,28.6 41,28.6
  pour Bottom: 41,30.5 41,28.5 18.5,28.5 17,30 12,30 11.5,30.5 11.5,31 12,31.5 30.5,31.5 31,32 31,36 31.5,36.5 32,36.5 32.5,36 32.5,32 33,31.5 40,31.5
VIN  (via drill 0.3)  (1 unrouted)
  Top 0.3: v12.9,23.3 13.2,23 | C2.1 13.3,22.9 v12.9,23.3 | U1.5 13.05,24.35 12.1,23.4 | 12.1,23.4 11.7,23 10.1,23 L1.1 | v12.9,23.3 12.2,23.3 12.1,23.4 | K1.1 46.8,33.55 46.8,34.5 46.4,34.9 C5.1 v44.96,35.54 40.8,39.7 36.2,39.7 31.7,44.2 31.7,46.4 30.14,47.96 C7.2 29.5,48.5 29.05,48.95 J7.1 | U1.8 18.25,25.35 v18.5,25.1 18.54,25.06 R3.2
  Top 0.6: 10.3,21.5 10.3,22.6 L1.1 | C1.1 10.4,21.4 10.3,21.5 | J1.T 6.14,22.86 7.5,21.5 10.3,21.5 | JP1.1 v40.7,27
  Bottom 0.8: v44.96,35.54 44.96,29.56 42.4,27 v40.7,27 39,25.3 18.7,25.3 v18.5,25.1 16.7,23.3 v12.9,23.3
  pour Top (isolate 0.3, no thermals): 5.2,25.1 5.2,22 7.2,20 13.4,20 13.9,20.5 13.9,24.5 13.2,24.5 12,23.3 8.3,23.3 7.1,24.5 7.1,25.1 6.5,25.7 5.8,25.7

### Text on the board
tPlace: - | +
tNames: Seeed | ReButton | ES2 Oct 2018
bNames: ReButton | Seeed | ES2 Oct 2018 | GND | TX | RX